# EAGLE design cubex_radio (EAGLE 6.4)
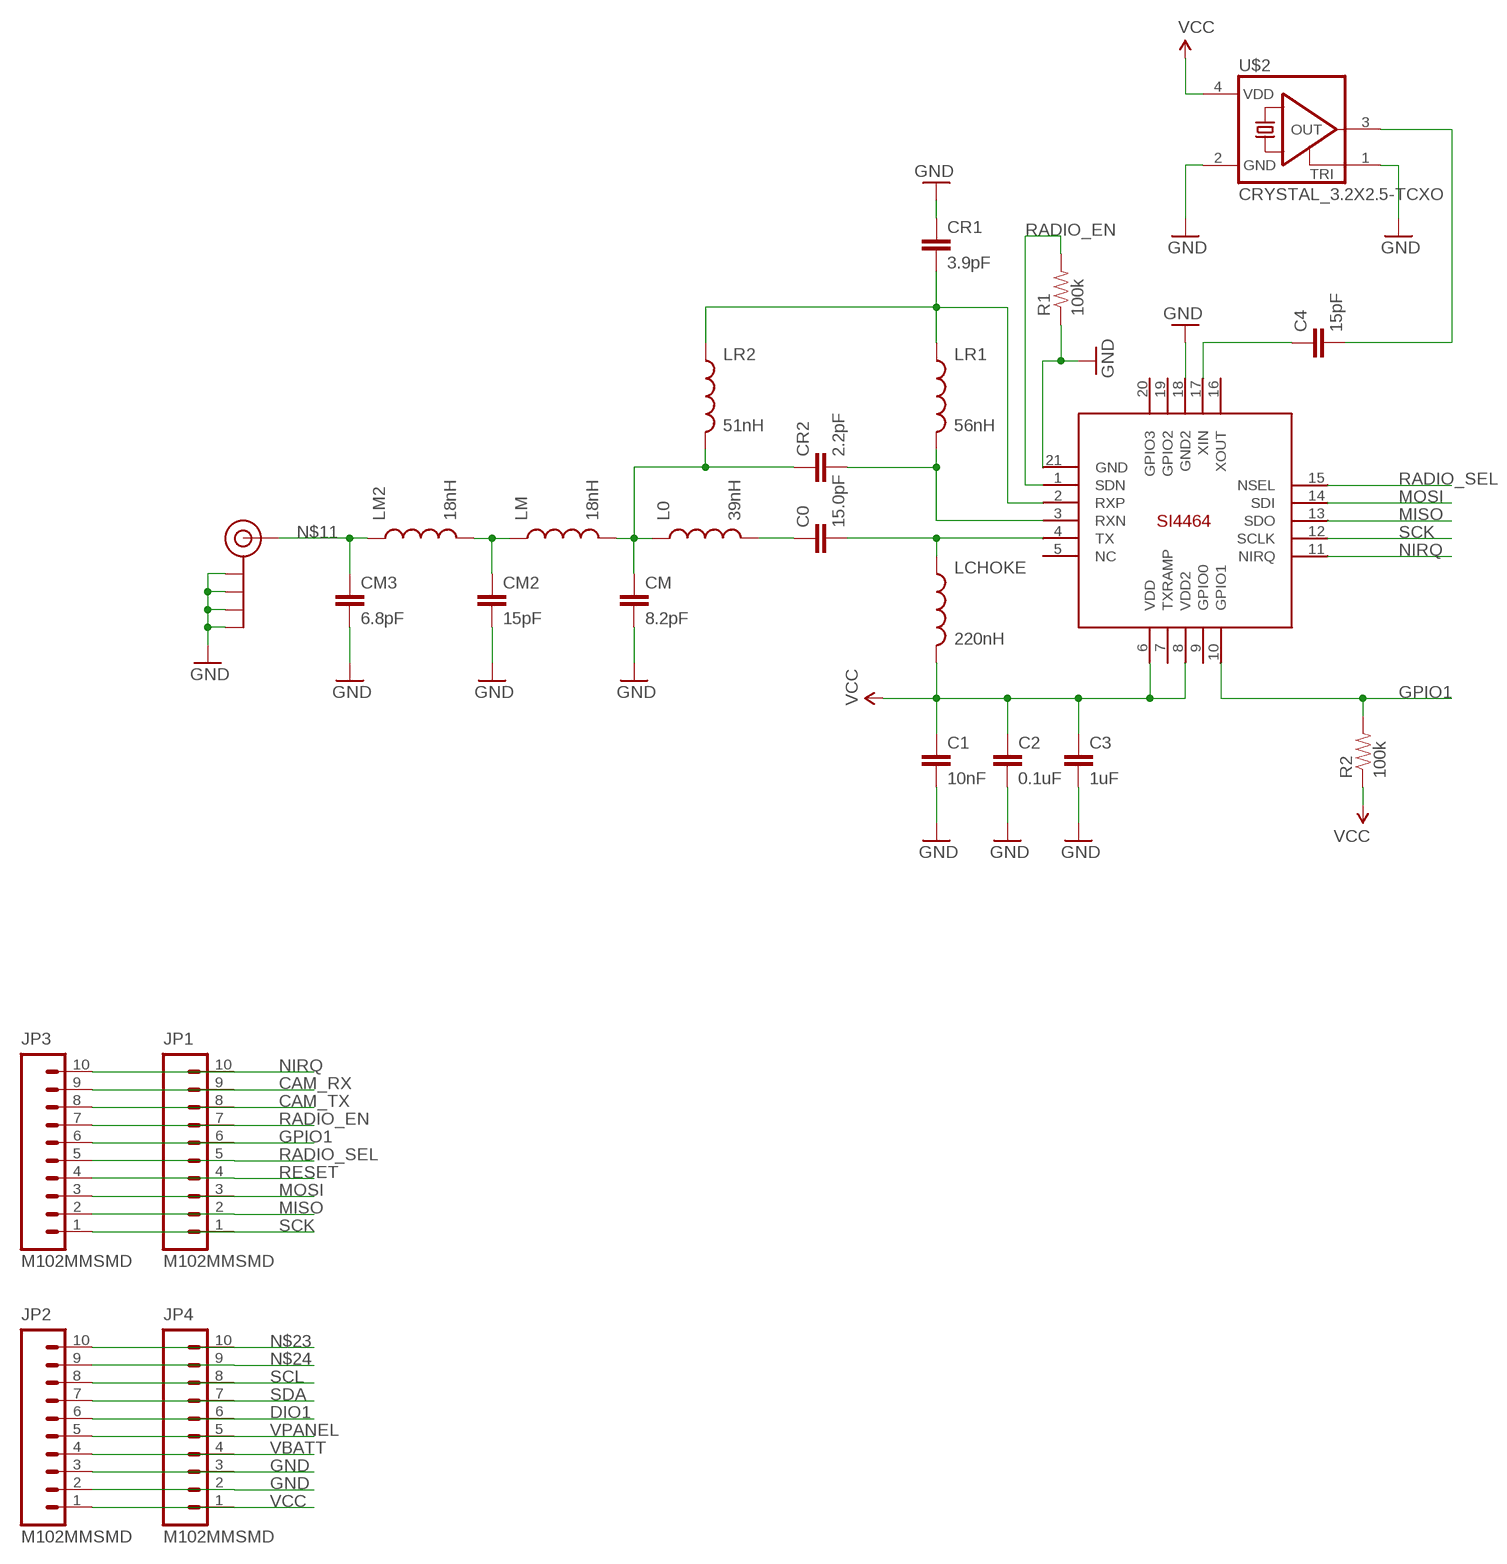
[diagram p0: schematic, sheet 1]

## Parts
C0  15.0pF  CAP0805  [0805]
C1  10nF  CAP0805  [0805]
C2  0.1uF  CAP0805  [0805]
C3  1uF  CAP0805  [0805]
C4  15pF  CAP0805  [0805]
CM  8.2pF  CAP0805  [0805]
CM2  15pF  CAP0805  [0805]
CM3  6.8pF  CAP0805  [0805]
CR1  3.9pF  CAP0805  [0805]
CR2  2.2pF  CAP0805  [0805]
J$1  SMA_EDGE  [SMA-EDGE]
JP1  M102MMSMD  [1X10-2MM-SMD]
JP2  M102MMSMD  [1X10-2MM-SMD]
JP3  M102MMSMD  [1X10-2MM-SMD]
JP4  M102MMSMD  [1X10-2MM-SMD]
L0  39nH  INDUCTOR0805  [0805]
LCHOKE  220nH  INDUCTOR0805  [0805]
LM  18nH  INDUCTOR0805  [0805]
LM2  18nH  INDUCTOR0805  [0805]
LR1  56nH  INDUCTOR0805  [0805]
LR2  51nH  INDUCTOR0805  [0805]
R1  100k  RESISTOR0805-RES  [0805]
R2  100k  RESISTOR0805-RES  [0805]
U$1  SI4464  [QFN20+GNDPAD]
U$2  CRYSTAL_3.2X2.5-TCXO  [CRYSTAL_3.2X2.5-TCXO]

## Nets
CAM_RX: JP1.9 JP3.9
CAM_TX: JP1.8 JP3.8
DIO1: JP2.6 JP4.6
GND: C1.2 C2.2 C3.2 CM2.2 CM3.2 CM.2 CR1.1 J$1.GND@0(GND) J$1.GND@1(GND) J$1.GND@2(GND) J$1.GND@3(GND) JP2.2 JP2.3 JP4.2 JP4.3 R1.1 U$1.18(GND2) U$1.21(GND) U$2.1(TRI) U$2.2(GND)
GPIO1: JP1.6 JP3.6 R2.2 U$1.10(GPIO1)
MISO: JP1.2 JP3.2 U$1.13(SDO)
MOSI: JP1.3 JP3.3 U$1.14(SDI)
N$1: C0.2 LCHOKE.1 U$1.4(TX)
N$2: CR2.2 LR1.2 U$1.3(RXN)
N$3: CR1.2 LR1.1 LR2.1 U$1.2(RXP)
N$9: C0.1 L0.2
N$10: CM.1 CR2.1 L0.1 LM.2 LR2.2
N$11: CM3.1 J$1.SIG(SIGNAL) LM2.1
N$15: CM2.1 LM2.2 LM.1
N$21: C4.1 U$1.17(XIN)
N$22: C4.2 U$2.3(OUT)
N$23: JP2.10 JP4.10
N$24: JP2.9 JP4.9
NIRQ: JP1.10 JP3.10 U$1.11(NIRQ)
RADIO_EN: JP1.7 JP3.7 R1.2 U$1.1(SDN)
RADIO_SEL: JP1.5 JP3.5 U$1.15(NSEL)
RESET: JP1.4 JP3.4
SCK: JP1.1 JP3.1 U$1.12(SCLK)
SCL: JP2.8 JP4.8
SDA: JP2.7 JP4.7
VBATT: JP2.4 JP4.4
VCC: C1.1 C2.1 C3.1 JP2.1 JP4.1 LCHOKE.2 R2.1 U$1.6(VDD) U$1.8(VDD2) U$2.4(VDD)
VPANEL: JP2.5 JP4.5
Unconnected: U$1.5(NC ) U$1.7(TXRAMP) U$1.9(GPIO0) U$1.16(XOUT) U$1.19(GPIO2) U$1.20(GPIO3)

## Library data of the parts
C0 C1-C4 CM CM2 CM3 CR1 CR2 = SparkFun:CAP: Capacitor Standard 0603 ceramic capacitor, and 0.1" leaded capacitor.
J$1 = SparkFun:SMA_EDGE: SMA Antenna Connector End launch SMA connector. The paste layer has been removed so that the connector can be hand soldered onto the board after reflow.
JP1-JP4 = SparkFun:M10: Header 10 Standard 10-pin 0.1" header. Use with straight break away headers (SKU : PRT-00116), right angle break away headers (PRT-00553), swiss pins (PRT-00743), machine pins (PRT-00117), and female headers (PRT-00115).
L0 LCHOKE LM LM2 LR1 LR2 = SparkFun:INDUCTOR: Inductors Basic Inductor/Choke - 0603 and 1206. Footprints are not proven and vary greatly between part numbers.
R1 R2 = SparkFun:RESISTOR: Resistor Basic schematic elements and footprints for 0603, 1206, and PTH resistors.
U$1 = Ava:SI4464
U$2 = picoAVA-R8:CRYSTAL_3.2X2.5-TCXO

## Board
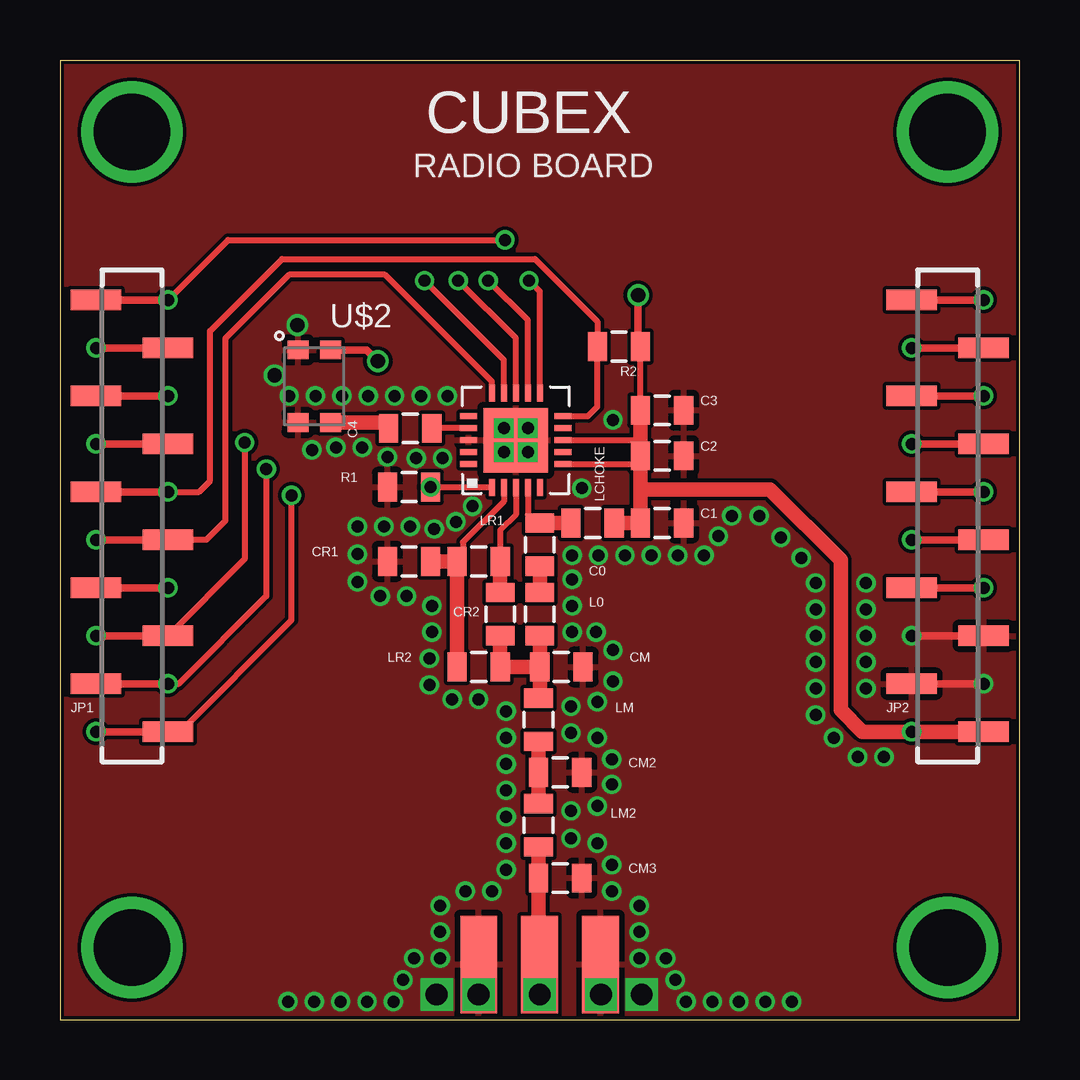
[diagram p1: board, top side]
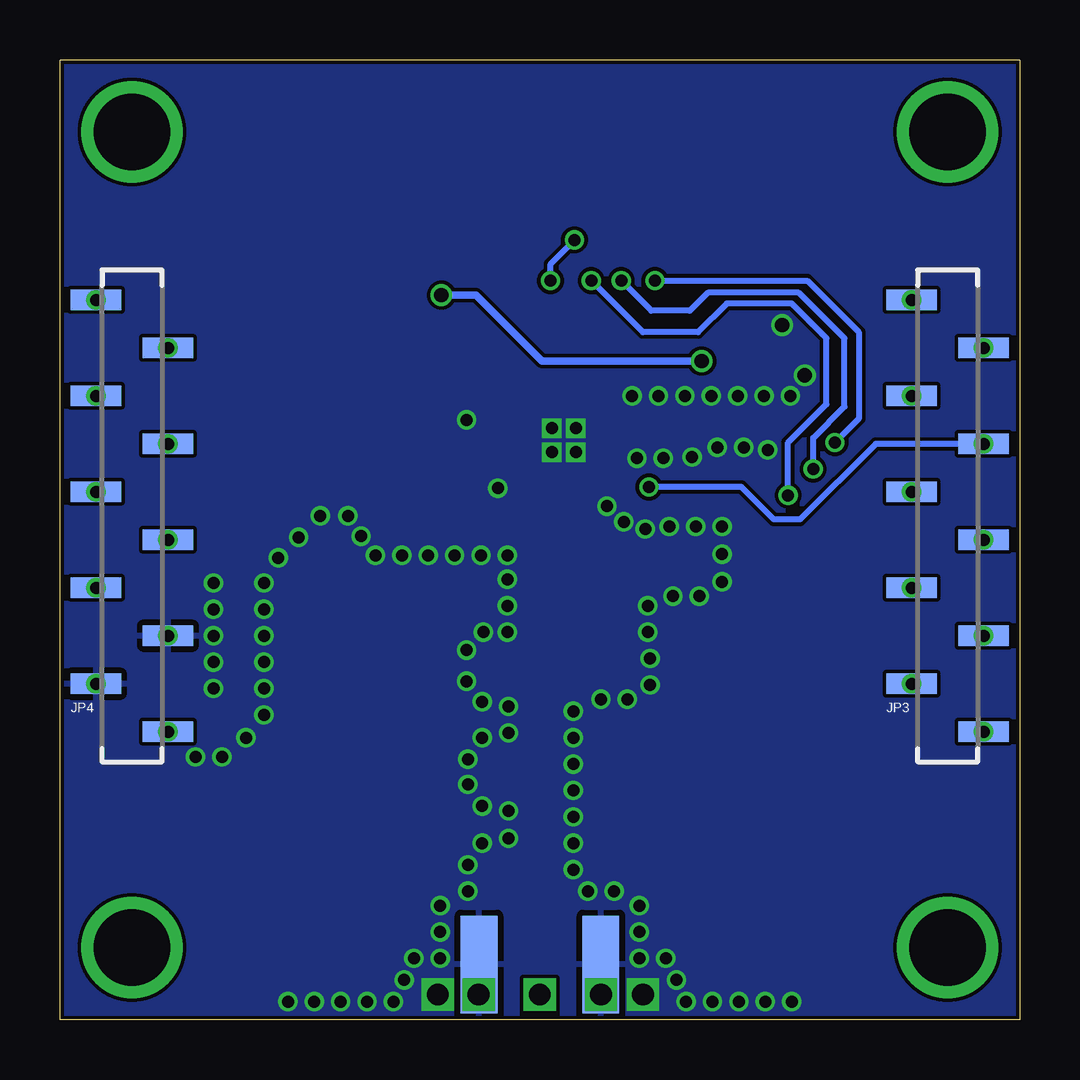
[diagram p2: board, bottom side, seen from below]

Size 40 x 40 mm. Coordinates in mm from the lower left corner, seen from the top.
Outline: 0,0 40,0 40,40 0,40 0,0
Copper layers (1*16): Top 0.035mm / dielectric 1.5mm / Bottom 0.035mm
Design rules "hackvana": minimum track width 6mil, minimum drill 0.3mm, track to track 6mil, track to pad 6mil, pad to pad 6mil, via to via 6mil, smd to smd 0mil, copper to edge 6mil, drill to drill 6mil, minimum pad ring 10mil, minimum via ring 6mil, stop-mask expansion 2mil, vias tented up to drill 100mil, thermal gap 10mil

### Footprints (pad centres in the part's own frame; a part is rotated, then mirrored left to right if it is on the bottom)
0805 = smd 0.8 x 1.2: 1 -0.9,0; 2 0.9,0
SMA-EDGE = smd 1.524 x 4.064: GND@0 0,0; GND@1 5.08,0; SIG 2.54,0 | smd 1.524 x 4.064 bottom: GND@2 0,0; GND@3 5.08,0
1X10-2MM-SMD = smd 0.85 x 2.1: 1 0,-1.5; 2 2,1.5; 3 4,-1.5; 4 6,1.5; 5 8,-1.5; 6 10,1.5; 7 12,-1.5; 8 14,1.5; 9 16,-1.5; 10 18,1.5
QFN20+GNDPAD = smd 0.7 x 0.25: 1 -1.97,1; 2 -1.97,0.5; 3 -1.97,0; 4 -1.97,-0.5; 5 -1.97,-1; 11 1.97,-1; 12 1.97,-0.5; 13 1.97,0; 14 1.97,0.5; 15 1.97,1 | smd 0.25 x 0.7: 6 -1,-1.97; 7 -0.5,-1.97; 8 0,-1.97; 9 0.5,-1.97; 10 1,-1.97; 16 1,1.97; 17 0.5,1.97; 18 0,1.97; 19 -0.5,1.97; 20 -1,1.97 | smd 2.7 x 2.7: 21 0,0
CRYSTAL_3.2X2.5-TCXO = smd 0.78 x 0.87: 1 -1.515,-0.68; 2 1.515,-0.68; 3 1.515,0.68; 4 -1.515,0.68

### Placement (x,y rotation side)
C0  20,19.8 90 top
C1  25.1,20.7 0 top
C2  25.1,23.5 0 top
C3  25.1,25.4 0 top
C4  14.6,24.65 180 top
CM  20.9,14.7 0 top
CM2  20.85,10.3 0 top
CM3  20.85,5.9 0 top
CR1  14.55,19.1 0 top
CR2  18.35,16.9 90 top
J$1  17.45,2.3 0 top
JP1  3,12 90 top
JP2  37,12 90 top
JP3  3,12 90 bottom
JP4  37,12 90 bottom
L0  20,16.9 90 top
LCHOKE  22.2,20.7 0 top
LM  19.95,12.5 90 top
LM2  19.95,8.1 90 top
LR1  17.45,19.1 0 top
LR2  17.45,14.7 0 top
R1  14.55,22.2 0 top
R2  23.3,28.05 180 top
U$1  19,24.15 90 top
U$2  10.6,26.4 270 top

### Tracks (layer width: path | path; a pad name or v marks a point on that pad's centre or on a via)
CAM_RX  (via drill 0.5)
  Top 0.305: JP1.9 JP3.9
  other vias: 1.5,28
CAM_TX  (via drill 0.5)
  Top 0.305: JP1.8 JP3.8
  other vias: 4.5,26
DIO1  (via drill 0.5)
  Top 0.305: JP2.6 JP4.6
  other vias: 38.5,22
GND  (via drill 0.5, 0.6, 0.9)
  Top 0.305: JP2.2 JP4.2 | JP2.3 JP4.3
  Top 0.406: v18.5,24.65 U$1.21
  other vias: 38.5,14 35.5,16 18.5,23.65 19.5,23.65 19.5,24.65 9.9,28.95 8.95,26.85 21.35,17.25 21.35,18.35 21.35,16.15 26.85,19.35 25.75,19.35 21.35,19.35 22.45,19.35 23.55,19.35 24.65,19.35 27.45,20.15 28,21 29.15,21 30.05,20.1 30.9,19.25 31.5,18.2 31.5,17.1 31.5,16 31.5,14.9 31.5,13.8 31.5,12.7 32.25,11.75 33.25,10.95 34.35,10.95 33.6,18.2 33.6,17.1 33.6,16 33.6,14.9 33.6,13.8 21.75,22.15 23.05,25 16.15,26 15.05,26 13.95,26 12.85,26 11.75,26 10.65,26 9.55,26 10.5,23.75 11.5,23.85 12.6,23.85 13.65,23.45 14.85,23.4 15.95,23.4 17.2,21.4 16.5,20.75 15.6,20.45 14.6,20.55 13.5,20.55 12.4,20.55 12.4,19.4 12.4,18.25 13.35,17.65 14.45,17.65 15.5,17.25 15.5,16.15 15.4,15.05 15.4,13.95 16.35,13.35 17.45,13.35 18.6,12.85 18.6,11.75 18.6,10.65 18.6,9.55 18.6,8.45 18.6,7.35 18.6,6.25 18,5.35 16.9,5.35 15.85,4.75 15.85,3.65 15.85,2.55 14.75,2.55 14.3,1.65 13.9,0.75 12.8,0.75 9.5,0.75 11.7,0.75 10.6,0.75 30.5,0.75 29.4,0.75 28.3,0.75 27.2,0.75 26.1,0.75 25.65,1.65 25.25,2.55 24.15,2.55 24.15,3.65 24.15,4.75 23,5.35 23,6.45 22.4,7.35 21.3,7.55 21.3,8.7 22.4,8.9 23,9.8 22.35,16.15 23.05,15.4 23.05,14.1 22.4,13.25 21.3,13.05 21.3,11.95 22.4,11.75 23,10.85 17.45,1.05 15.7,1.05 24.25,1.05 22.55,1.05
  pour Top: 0,40 40,40 40,0 0,0
  pour Bottom: 0,40 40,40 40,0 0,0
GPIO1  (via drill 0.5)
  Top 0.254: U$1.10 22,25.15 22.4,25.55 R2.2 22.4,29.1 19.8,31.7 9.25,31.7 6.25,28.7 6.25,22.45 5.8,22 JP3.6
  Top 0.305: JP1.6 JP3.6
  other vias: 4.5,22
MISO  (via drill 0.5)
  Top 0.254: U$1.13 19,28.4 v16.6,30.8 | JP3.2 4.95,14 8.6,17.65 v8.6,22.95
  Top 0.305: JP1.2 JP3.2
  Bottom 0.254: v8.6,22.95 8.6,24.25 7.3,25.55 7.3,28.4 9.2,30.3 13,30.3 13.75,29.55 15.35,29.55 v16.6,30.8
  other vias: 4.5,14
MOSI  (via drill 0.5)
  Top 0.254: U$1.14 18.5,27.5 v15.2,30.8 | JP1.3 7.7,19.2 v7.7,24.05
  Top 0.305: JP1.3 JP3.3
  Bottom 0.254: v15.2,30.8 8.85,30.8 6.7,28.65 6.7,25.05 v7.7,24.05
  other vias: 1.5,16
N$1
  Top 0.254: U$1.4 19.5,21.05 19.85,20.7 C0.2
  Top 0.61: LCHOKE.1 C0.2
N$2
  Top 0.254: U$1.3 19,21.05 18.35,20.4 LR1.2
  Top 0.61: LR1.2 CR2.2
N$3
  Top 0.254: U$1.2 18.5,21.6 16.8,19.9 16.8,19.35 LR1.1
  Top 0.61: CR1.2 LR1.1 LR2.1
N$5  (via drill 3.2)
  other vias: 3,3
N$7  (via drill 3.2)
  other vias: 37,3
N$8  (via drill 3.2)
  other vias: 37,37
N$9
  Top 0.61: C0.1 L0.2
N$10
  Top 0.61: 20.05,13.45 LM.2 20,13.5 CM.1 | CR2.1 LR2.2 CM.1 | L0.1 CM.1
N$11  (via drill 0.9)
  Top 0.61: LM2.1 CM3.1 19.95,2.34 J$1.SIG
  Top 1.016: J$1.SIG v19.99,1.06 v20,1.05
N$12  (via drill 3.2)
  other vias: 3,37
N$15
  Top 0.61: 20,10.35 CM2.1 | CM2.1 LM2.2 | LM.1 CM2.1
N$21
  Top 0.254: U$1.17 C4.1
N$22
  Top 0.61: U$2.3 13.46,24.89 C4.2
N$23  (via drill 0.5)
  Top 0.305: JP2.10 JP4.10
  other vias: 38.5,30
N$24  (via drill 0.5)
  Top 0.305: JP2.9 JP4.9
  other vias: 35.5,28
NIRQ  (via drill 0.5)
  Top 0.254: U$1.11 20,30.35 v19.55,30.8 | v18.55,32.5 7,32.5 JP3.10
  Top 0.305: JP1.10 JP3.10
  Bottom 0.254: v19.55,30.8 19.55,31.5 v18.55,32.5
  other vias: 4.5,30
RADIO_EN  (via drill 0.5)
  Top 0.254: U$1.1 15.47,22.18 R1.2
  Top 0.305: JP1.7 JP3.7
  Bottom 0.254: JP3.7 6,24 9.15,20.85 10.25,20.85 11.6,22.2 R1.2
  other vias: 1.5,24 15.45,22.2
RADIO_SEL  (via drill 0.5)
  Top 0.254: U$1.15 18,26.6 13.55,31.05 9.55,31.05 6.9,28.4 6.9,20.8 6.1,20 JP1.5
  Top 0.305: JP1.5 JP3.5
  other vias: 1.5,20
RESET  (via drill 0.5)
  Top 0.305: JP1.4 JP3.4
  other vias: 4.5,18
SCK  (via drill 0.5)
  Top 0.254: U$1.12 19.5,29.15 v17.85,30.8 | JP1.1 5,12 9.65,16.65 v9.65,21.85
  Top 0.305: JP1.1 JP3.1
  Bottom 0.254: v9.65,21.85 9.65,24.05 8.05,25.65 8.05,28.4 9.5,29.85 12.2,29.85 13.4,28.65 15.7,28.65 v17.85,30.8
  other vias: 1.5,12
SCL  (via drill 0.5)
  Top 0.305: JP2.8 JP4.8
  other vias: 38.5,26
SDA  (via drill 0.5)
  Top 0.305: JP2.7 JP4.7
  other vias: 35.5,24
VBATT  (via drill 0.5)
  Top 0.305: JP2.4 JP4.4
  other vias: 38.5,18
VCC  (via drill 0.5, 0.6)
  Top 0.254: U$1.6 23.85,23.15 C2.1 | U$1.8 24.1,24.15 24.2,24.05 | C3.1 R2.1
  Top 0.305: U$2.4 12.79,27.91 v13.25,27.45 | v24.1,30.2 24.1,28.15 R2.1
  Top 0.61: JP2.1 JP4.1 33.45,12 32.55,12.9 32.55,19.15 29.6,22.1 24.25,22.1 24.2,22.05 | 24.2,22.05 C1.1 LCHOKE.2 | 24.2,22.05 C2.1 24.2,24.05 C3.1
  Bottom 0.305: v24.1,30.2 22.65,30.2 19.9,27.45 v13.25,27.45
  other vias: 35.5,12
VPANEL  (via drill 0.5)
  Top 0.305: JP2.5 JP4.5
  other vias: 35.5,20

### Text on the board
tNames: CUBEX | RADIO BOARD